# Altium schematic sheet Power.SchDoc
size 381 x 241 mm; SheetNumber: 2; SheetTotal: 4
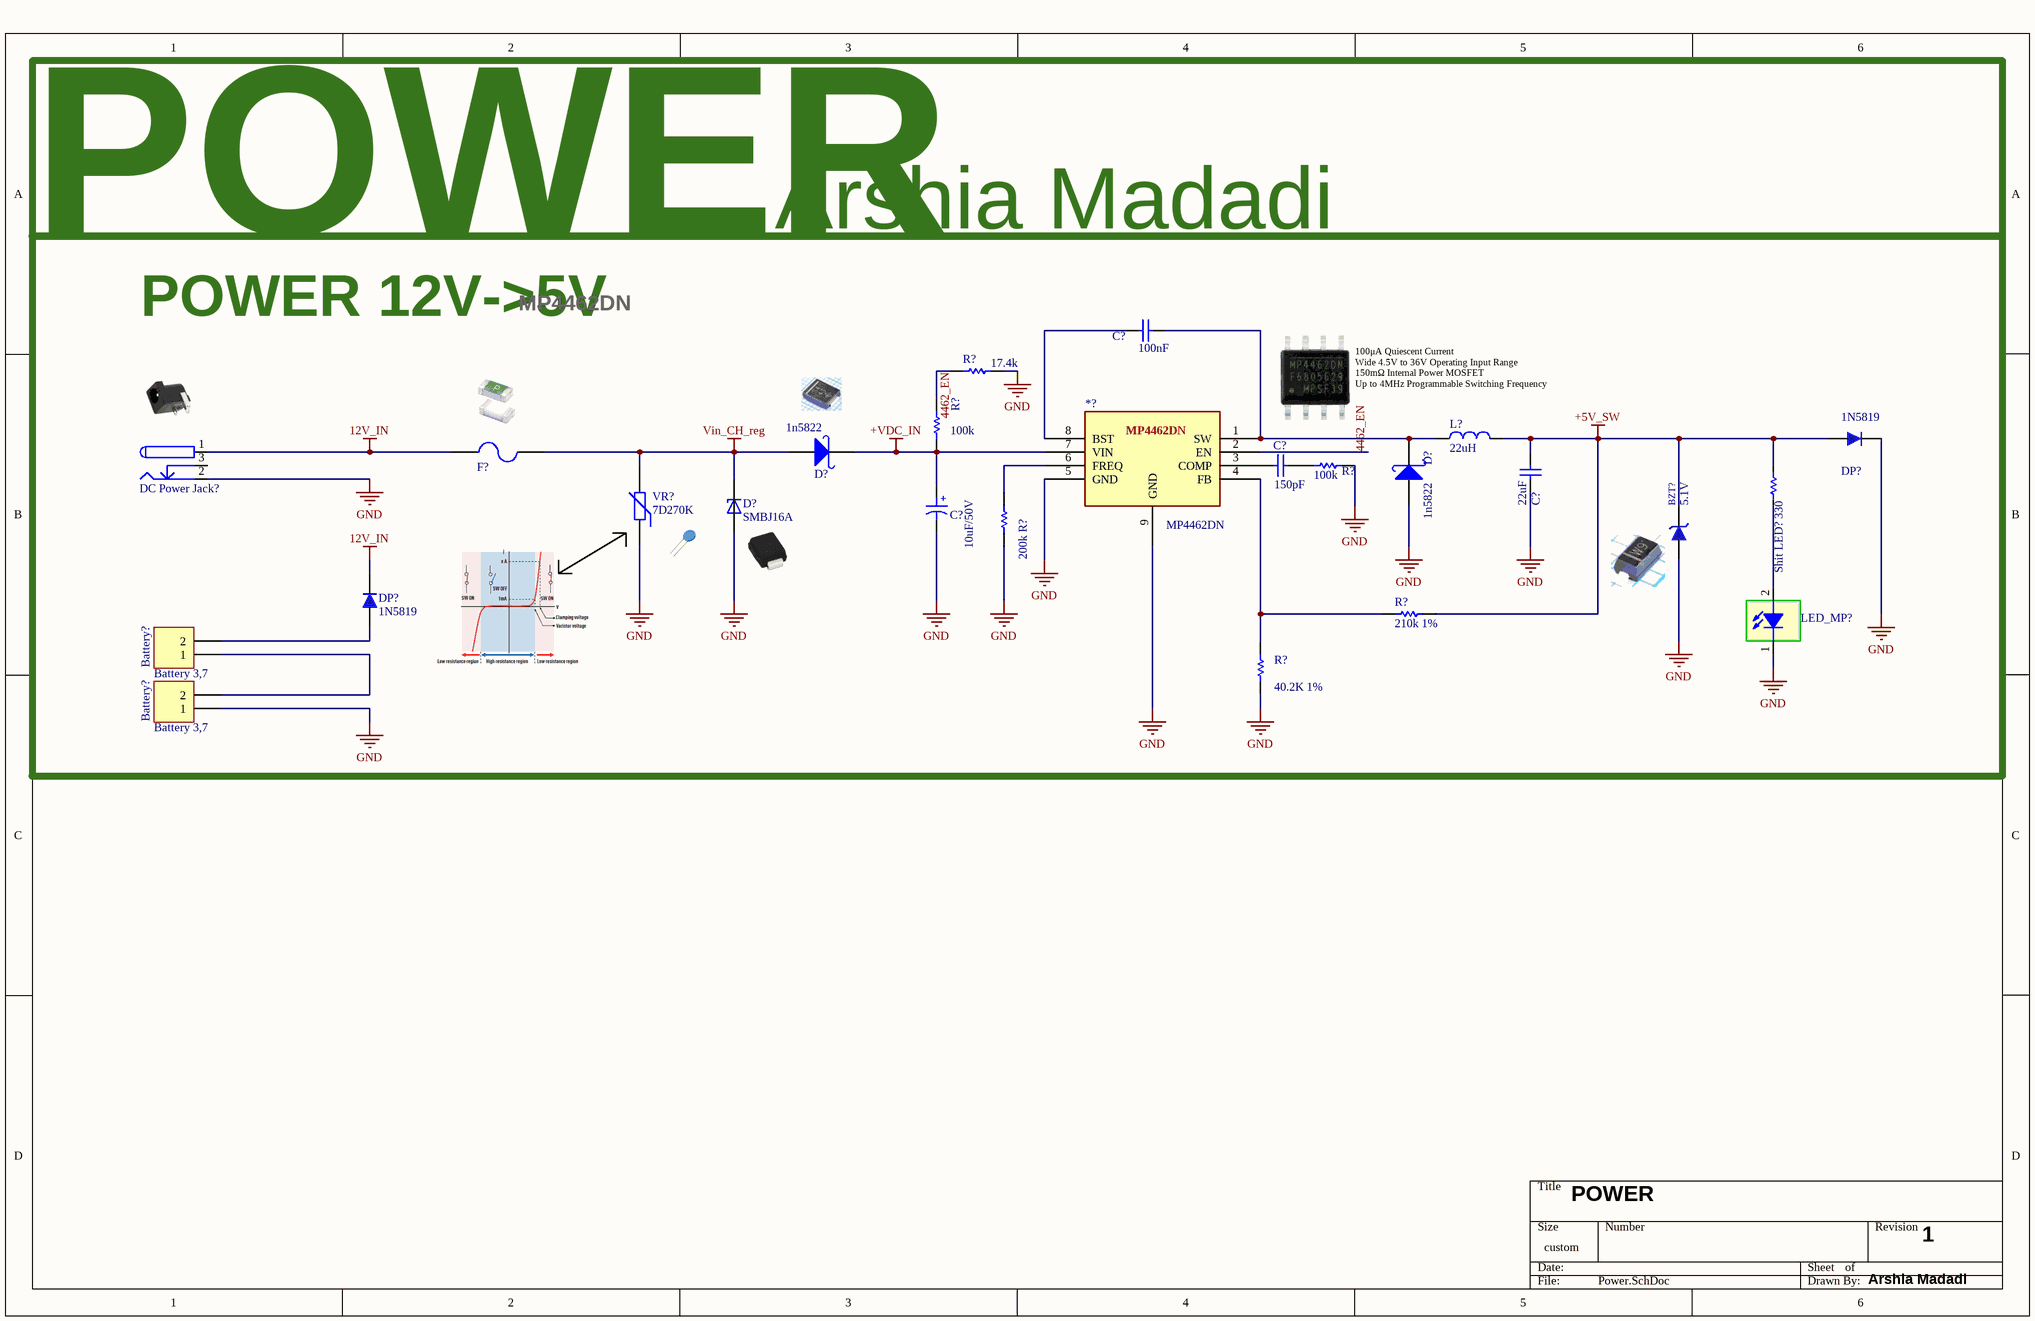
[diagram p0: Power.SchDoc]

## Parts
(Parts that share a designator on the sheet are numbered #1, #2 ... from top to bottom, then left to right.)
*?  MP4462DN  [PCBComponent_1 - duplicate]
Battery?#1  Battery 3,7  [HDR1X2]
Battery?#2  Battery 3,7  [HDR1X2]
BZT?  5.1V  [SOD123]
C?#1  100nF  [CAP1206]
C?#2  150pF  [CAP1206]
C?#3  22uF  [CAP1206]
C?#4  Part. No: 10uF/50V  [Cap electrolitic radial 10x20-5]  (hidden comment: Cap 10x21)
D?#1  1n5822  [DO-214AB(SMC)]
D?#2  1n5822  [DO-214AB(SMC)]
D?#3  SMBJ16A  [DIOM4336X265N]
DC_Power_Jack?  DC Power Jack  [DC Power Jack 1]  (value not drawn)
DP?#1  1N5819  [1n58XX DO-201AD]
DP?#2  1N5819  [1n58XX DO-201AD]
F?  F=3.0 A  [1206 FUSE]  (value not drawn)
L?  value 22uH  [0805 - big]  (hidden comment: 10uH)
LED_MP?  SMD 1206 LED  [LED 1206]  (value not drawn)
R?#1  17.4k  [RESC4817X04N]
R?#2  100k  [RESC4817X04N]
R?#3  100k  [RESC4817X04N]
R?#4  200k  [RESC4817X04N]
R?#5  210k 1%  [RESC4817X04N]
R?#6  40.2K 1%  [RESC4817X04N]
Shit_LED?  330  [1206_Res]
VR?  7D270K  [07D XXX]

## Nets
12V_IN: DC_Power_Jack?.1 DP?#2.2 F?.1
+5V_SW: BZT?.2 C?#3.1 DP?#1.1 L?.2 R?#5.2 Shit_LED?.2
+VDC_IN: *?.7(VIN) C?#4.1 D?#1.2(K) R?#2.2
GND: *?.5(GND) *?.9(GND) Battery?#2.1 BZT?.1 C?#3.2 C?#4.2 D?#2.1(A) D?#3.A DC_Power_Jack?.2 DP?#1.2 LED_MP?.1 R?#1.2 R?#3.2 R?#4.1 R?#6.1 VR?.1
Vin_CH_reg: D?#1.1(A) D?#3.C F?.2 VR?.2
4462_EN: *?.2(EN) R?#1.1 R?#2.1
Net*?_1: *?.1(SW) C?#1.1 D?#2.2(K) L?.1
Net*?_3: *?.3(COMP) C?#2.2
Net*?_4: *?.4(FB) R?#5.1 R?#6.2
Net*?_6: *?.6(FREQ) R?#4.2
Net*?_8: *?.8(BST) C?#1.2
NetBattery?#1_1: Battery?#1.1 Battery?#2.2
NetBattery?#1_2: Battery?#1.2 DP?#2.1
NetC?#2_1: C?#2.1 R?#3.1
NetLED_MP?_2: LED_MP?.2 Shit_LED?.1

Not connected (* = marked no-connect by the designer): DC_Power_Jack? 3

## Notes on the sheet
- Arshia Madadi
- POWER
- POWER 12V->5V
- MP4462DN
- (near L?) 100μA Quiescent Current
  Wide 4.5V to 36V Operating Input Range
  150mΩ Internal Power MOSFET
  Up to 4MHz Programmable Switching Frequency
- 1
- (in symbol Cap electrolitic radial 10x21) +

## Library data of the parts
Battery?#1 Battery?#2 = Header 2: Header, 2-Pin; LatestRevisionDate: 17-Jul-2002; LatestRevisionNote: Re-released for DXP Platform.; Publisher: Altium Limited
BZT? = ZENER GENERAL DIODE: DIODE ZENER GENERAL; VALUE: 12V; Published: 2017-1-12; PackageVersion: 2017-1-12; PackageReference: DO 35; Publisher: Abbas Basereh; PackageDescription: DIODE GEN ZENER; ComponentLink1Description: Manufacturer Link; ComponentLink2Description: Datasheet
C?#1 = CAP SMD PACKAGE: TOTAL CAPACITOR SMD PACK; Designer: Abbas Basereh; Desc.: CAP SMD TOTAL PACKAGES; Data: 2017-3-10; VALUE: 100nF
C?#2 C?#3 = CAP SMD PACKAGE: TOTAL CAPACITOR SMD PACK; Designer: Abbas Basereh; Desc.: CAP SMD TOTAL PACKAGES; VALUE: 100nF; Data: 2017-3-10
C?#4 = Cap electrolitic radial 10x21: Cap electrolitic radial; Designer: Abbas Basereh; Data: 16-12-2016
D?#1 D?#2 = 1N5822 SMD: Schottky Rectifiers; Part. No: SS34; Manufacturer: ON Semiconductor/Fairchild; Designer: Abbas Basereh; Link: https://www.aliexpress.com/item/Free-shipping-100pcs-1n5822-sma-smd-do-214ac-Schottky-diode-ss34/32337482329.html?spm=2114.01010208.3.1.zLZDsP&ws_ab_test=searchweb0_0,searchweb201602_4_10065_10068_10084_10083_10080_10082_10081_10060_10061_10062_10056_10055_10054_10059_10099_10078_10079_427_10073_10103_10102_10096_10052_10050_10051,searchweb201603_4&btsid=6e50dc92-ac69-45bc-a19e-209af19ce602; Link: http://www.tme.eu/en/details/ss34/smd-schottky-diodes/vishay/ss34-e357t/; Link: http://www.digikey.com/product-detail/en/on-semiconductor-fairchild/SS34/SS34FSCT-ND/2094459; Data: 16-12-2016
D?#3 = SMBJ16A: 600W, 18.8V, 5%, Unidirectional, TVS; MF: Taiwan Semiconductor; MP: SMBJ16A; SnapEDA_Link: https://www.snapeda.com/parts/SMBJ16A/Taiwan+Semiconductor/view-part/?ref=snap; Check_prices: https://www.snapeda.com/parts/SMBJ16A/Taiwan+Semiconductor/view-part/?ref=eda; Price: None; Availability: In Stock; Purchase-URL: https://pricing.snapeda.com/search/part/SMBJ16A/?ref=eda; Package: SMD-2-2 Avago; Value: *
DC_Power_Jack? = DC Power Jack: DC Power Jack. Center Pin 2.5mm. Diameter: 5.7mm; Designer: Ali Hafizi; Company: Personal; Project Name: Laser; Adding Date: 10/21/2009
DP?#1 DP?#2 = 1N5819: Schottkey Rectifiers; Designer: Abbas Basereh; Data: 16-12-2016; Link: *; Part. No: *
F? = Fuse SMD1206: SMD Fuses 1206; Designer: Abbas Basereh; Desc.: SMD Fuses 1206; Data: 16-12-2016
L? = Inductor: Code_IEC: 1005; Published: 8-Jun-2000; LatestRevisionDate: 17-Jul-2002; LatestRevisionNote: Re-released for DXP Platform.; PackageReference: 0402-A; Publisher: Altium Limited; Code_JEITA: 0402
LED_MP? = LED SMD 1206
R?#1-R?#6 = RES 1206 0.25W: RES 1206; Designer: Abbas Basereh; Desc.: RES SMD 1206; Data: 16-12-2016
Shit_LED? = Res: Resistor; Published: 8-Jun-2000; LatestRevisionDate: 17-Jul-2002; LatestRevisionNote: Re-released for DXP Platform.; PackageReference: AXIAL-0.3; Publisher: Altium Limited
VR? = VARISTOR (VDR): VARISTORS; Manufacturer: china-canada-philipina; Designer: Abbas Basereh; VALUE: xxDxxx; Models: MOV-VDR-COV; Data: 2017-1-5; Link: digikey.com; PUBLISHER: ABBAS BASEREH